# EAGLE design Power_Supply-V_1_0_0_0 (EAGLE 6.4)
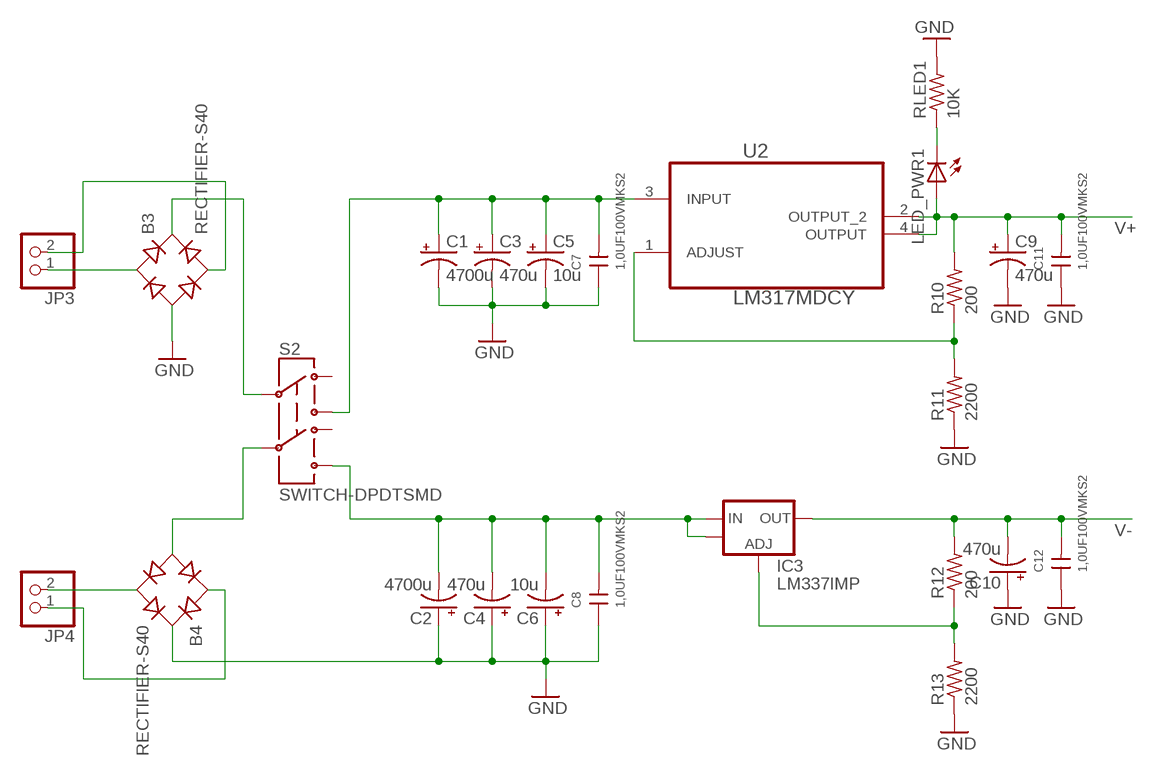
[diagram p0: schematic, sheet 1]

## Parts
B3  RECTIFIER-S40  [TO-269AA]
B4  RECTIFIER-S40  [TO-269AA]
C1  4700u  CPOL-USE7.5-16  [E7,5-16]
C2  4700u  CPOL-USE7.5-16  [E7,5-16]
C3  470u  CPOL-USE3.5-8  [E3,5-8]
C4  470u  CPOL-USE3.5-8  [E3,5-8]
C5  10u  CPOL-USE2-5  [E2-5]
C6  10u  CPOL-USE2-5  [E2-5]
C7  1,0UF100VMKS2  [7,2X13,0RM5,0]
C8  1,0UF100VMKS2  [7,2X13,0RM5,0]
C9  470u  CPOL-USE3.5-8  [E3,5-8]
C10  470u  CPOL-USE3.5-8  [E3,5-8]
C11  1,0UF100VMKS2  [7,2X13,0RM5,0]
C12  1,0UF100VMKS2  [7,2X13,0RM5,0]
IC3  LM337IMP  [SOT-223]
JP3  PINHD-1X2  [1X02]
JP4  PINHD-1X2  [1X02]
LED_PWR1  LEDCHIP-LED0603  [CHIP-LED0603]
R10  200  R-US_R0603  [R0603]
R11  2200  R-US_R0603  [R0603]
R12  200  R-US_R0603  [R0603]
R13  2200  R-US_R0603  [R0603]
RLED1  10K  R-US_R0603  [R0603]
S2  SWITCH-DPDTSMD  [AYZ0202]
U2  LM317MDCY  [SOT230P700X180-4N]

## Nets
GND: B3.- B4.+ C1.- C2.+ C3.- C4.+ C5.- C6.+ C7.1 C8.1 C9.- C10.+ C11.1 C12.1 R11.1 R13.1 RLED1.2
N$2: LED_PWR1.C RLED1.1
N$3: IC3.1(ADJ) R12.1 R13.2
N$8: B3.+ S2.2
N$9: R10.1 R11.2 U2.1(ADJUST)
N$11: B4.- S2.5
N$13: B4.AC1 JP4.1
N$14: B3.AC2 JP3.2
N$15: C1.+ C3.+ C5.+ C7.2 S2.3 U2.3(INPUT)
N$16: B3.AC1 JP3.1
N$17: B4.AC2 JP4.2
N$18: C2.- C4.- C6.- C8.2 IC3.2(IN) IC3.4 S2.6
V+: C9.+ C11.2 LED_PWR1.A R10.2 U2.2(OUTPUT_2) U2.4(OUTPUT)
V-: C10.- C12.2 IC3.3(OUT) R12.2
Unconnected: S2.1 S2.4

## Library data of the parts
B3 B4 = rectifier:RECTIFIER-: Rectifier
C1-C6 C9 C10 = rcl:CPOL-US: POLARIZED CAPACITOR, American symbol
C7 C8 C11 C12 = wima_c:1,0UF100V
IC3 = AWJLEagleLib:LM337: LM337 adjustable negative voltage regulator
JP3 JP4 = pinhead:PINHD-1X2: PIN HEADER
LED_PWR1 = adafruit:LED: LED OSRAM: - CHIPLED LG R971, LG N971, LY N971, LG Q971, LY Q971, LO R971, LY R971 LH N974, LH R974 LS Q976, LO Q976, LY Q976 LO Q996 - Hyper CHIPLED LW Q18S LB Q993, LB Q99A, LB R99A - SideLED LS A670, LO A670, LY A670, LG A670, LP A670 LB A673, LV A673, LT A673, LW A673 LH A674 LY A675 LS A676, LA A676, LO A676, LY A676, LW A676 LS A679, LY A679, LG A679 - Hyper Micro SIDELED® LS Y876, LA Y876, LO Y876, LY Y876 LT Y87S - SmartLED LW L88C, LW L88S LB L89C, LB L89S, LG L890 LS L89K, LO L89K, LY L89K LS L896, LA L896, LO L896, LY L896 - TOPLED LS T670, LO T670, LY T670, LG T670, LP T670 LSG T670, LSP T670, LSY T670, LOP T670, LYG T670 LG T671, LOG T671, LSG T671 LB T673, LV T673, LT T673, LW T673 LH T674 LS T676, LA T676, LO T676, LY T676, LB T676, LH T676, LSB T676, LW T676 LB T67C, LV T67C, LT T67C, LS T67K, LO T67K, LY T67K, LW E67C LS E67B, LA E67B, LO E67B, LY E67B, LB E67C, LV E67C, LT E67C LW T67C LS T679, LY T679, LG T679 LS T770, LO T770, LY T770, LG T770, LP T770 LB T773, LV T773, LT T773, LW T773 LH T774 LS E675, LA E675, LY E675, LS T675 LS T776, LA T776, LO T776, LY T776, LB T776 LHGB T686 LT T68C, LB T68C - Hyper Mini TOPLED® LB M676 - Mini TOPLED Santana® LG M470 LS M47K, LO M47K, LY M47K Source: http://www.osram.convergy.de/
R10-R13 RLED1 = rcl:R-US_: RESISTOR, American symbol
S2 = SparkFun:SWITCH-DPDT: DPDT Version of the COM-00597
U2 = Texas Instruments_By_element14_Batch_1:LM317MDCY: IC ADJ LINEAR REG 1.25V TO 37V; MPN: LM317MDCY; OC_FARNELL: 1648658; OC_NEWARK: 75C0818; PACKAGE: SOT-223-3; SUPPLIER: TEXAS INSTRUMENTS

## Board
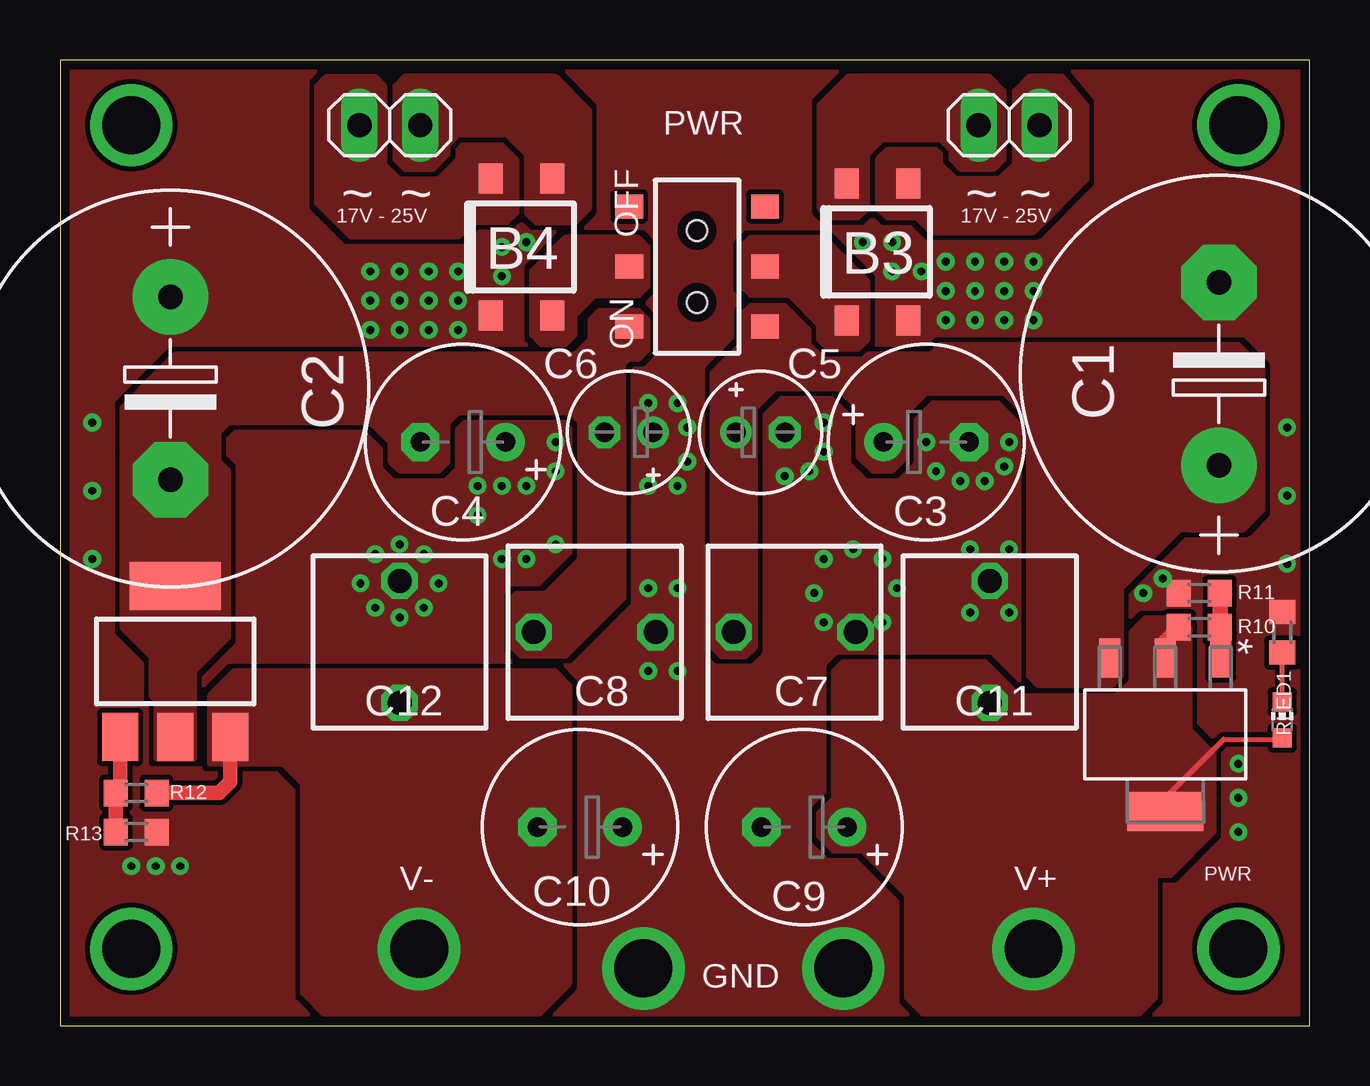
[diagram p1: board, top side]
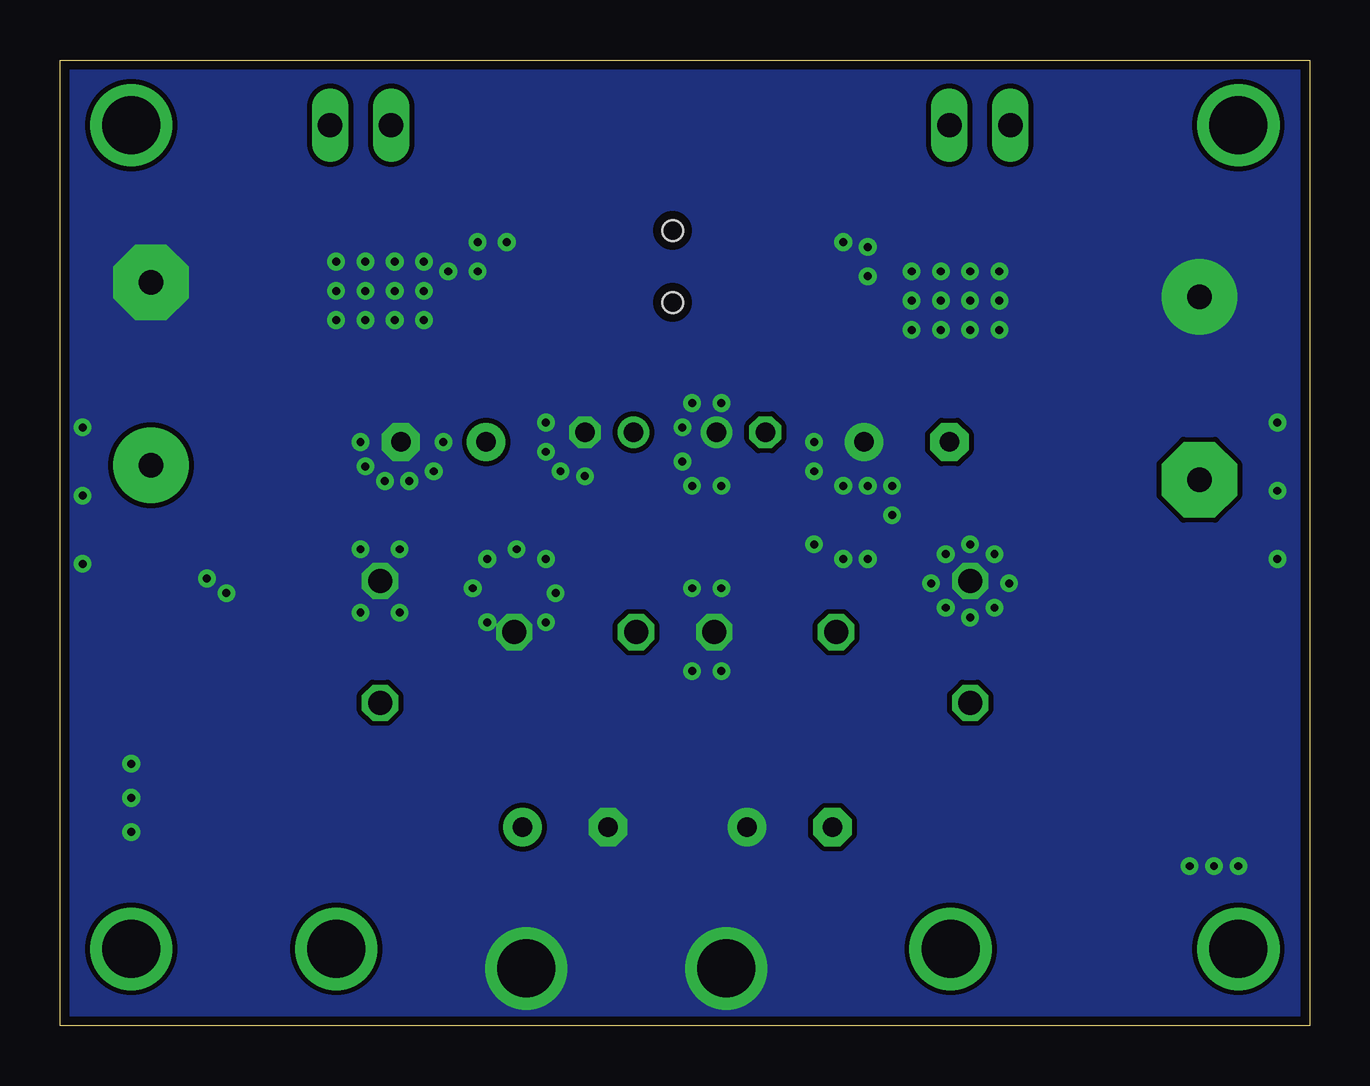
[diagram p2: board, bottom side, seen from below]

Size 52.07 x 40.26 mm. Coordinates in mm from the lower left corner, seen from the top.
Outline: 0,40.26 0,0 52.07,0 52.07,40.26 0,40.26
Copper layers (1*16): Top 0.035mm / dielectric 1.5mm / Bottom 0.035mm
Design rules "default *": minimum track width 8mil, minimum drill 13mil, track to track 8mil, track to pad 8mil, pad to pad 8mil, via to via 8mil, smd to smd 8mil, copper to edge 15mil, drill to drill 8mil, minimum pad ring 10mil, minimum via ring 8mil, stop-mask expansion 4mil, vias tented up to drill 14mil, thermal gap 10mil

### Footprints (pad centres in the part's own frame; a part is rotated, then mirrored left to right if it is on the bottom)
TO-269AA = smd 1 x 1.25: + -1.28,-2.855; - 1.28,-2.855; AC1 -1.28,2.855; AC2 1.28,2.855
E7,5-16 = drill 1.016 pad 3.15: + -3.81,0 | drill 1.016 pad 3.15 octagon: - 3.81,0
E3,5-8 = drill 0.813 pad 1.6: + -1.778,0 | drill 0.813 pad 1.6 octagon: - 1.778,0
E2-5 = drill 0.813 pad 1.27: + -1.016,0 | drill 0.813 pad 1.27 octagon: - 1.016,0
7,2X13,0RM5,0 = drill 1 pad 1.5 octagon: 1 -2.54,0; 2 2.54,0
SOT-223 = smd 1.5 x 2: 1 -2.3,-3.15; 2 0,-3.15; 3 2.3,-3.15 | smd 3.8 x 2: 4 0,3.15
1X02 = drill 1.016 long: 1 -1.27,0; 2 1.27,0
CHIP-LED0603 = smd 0.8 x 0.8: A 0,-0.75; C 0,0.75
R0603 = smd 1 x 1.1: 1 -0.85,0; 2 0.85,0
AYZ0202 = smd 1 x 1.15: 1 -2.5,2.825; 2 0,2.825; 3 2.5,2.825; 4 -2.5,-2.825; 5 0,-2.825; 6 2.5,-2.825 | hole 0.85: 1.5,0; -1.5,0
SOT230P700X180-4N = smd 1.626 x 0.889: 1 -3.2,2.311; 2 -3.2,0; 3 -3.2,-2.311 | smd 1.626 x 3.175: 4 3.2,0

### Placement (x,y rotation side)
B3  34.06,32.26 0 top
B4  19.23,32.47 0 top
C1  48.29,27.18 90 top
C2  4.6,26.57 270 top
C3  36.09,24.34 0 top
C4  16.79,24.34 180 top
C5  29.18,24.74 0 top
C6  23.7,24.74 180 top
C7  30.61,16.41 180 top
C8  22.28,16.41 180 top
C9  31.01,8.29 180 top
C10  21.67,8.29 180 top
C11  38.73,16.01 270 top
C12  14.15,16.01 270 top
IC3  4.8,15.19 0 top
JP3  39.55,37.55 0 top
JP4  13.74,37.55 0 top
LED_PWR1  50.93,12.76 0 top
R10  47.47,16.62 180 top
R11  47.47,18.04 0 top
R12  3.17,9.71 0 top
R13  3.17,8.08 180 top
RLED1  50.93,16.41 90 top
S2  26.54,31.65 270 top
U2  46.05,12.15 270 top

### Tracks (layer width: path | path; a pad name or v marks a point on that pad's centre or on a via)
GND  (via drill 0.33, 2.41)
  other vias: 16.59,29.01 15.37,29.01 14.15,29.01 12.93,29.01 16.59,30.23 15.37,30.23 14.15,30.23 12.93,30.23 16.59,31.45 15.37,31.45 14.15,31.45 12.93,31.45 19.43,32.67 18.41,32.47 18.41,31.25 36.91,29.42 38.13,29.42 39.34,29.42 40.56,29.42 36.91,30.64 38.13,30.64 39.34,30.64 40.56,30.64 40.56,31.86 39.34,31.86 38.13,31.86 36.91,31.86 33.45,32.67 34.67,32.67 34.67,31.45 35.89,31.45 1.35,25.15 1.35,22.31 1.35,19.46 3.99,6.66 5,6.66 2.97,6.66 20.65,24.34 20.65,23.12 20.65,20.07 19.43,22.51 19.43,19.46 18.41,22.51 18.41,19.46 17.4,22.51 17.4,21.29 24.51,25.96 25.73,25.96 26.14,24.95 26.14,23.53 25.73,22.51 24.51,22.51 24.51,18.24 25.73,18.24 25.73,14.79 24.51,14.79 39.55,24.34 36.09,24.34 36.5,23.12 37.52,22.71 38.53,22.71 39.34,23.32 31.83,25.15 31.83,23.93 31.22,23.12 30.2,22.92 31.42,18.04 33.05,16.41 34.87,18.24 33.05,19.87 31.83,19.46 31.83,16.82 34.26,16.82 34.26,19.46 45.95,18.65 45.14,18.04 24.31,2.39 51.13,24.95 51.13,22.1 51.13,19.26 39.55,17.23 37.92,17.23 37.92,19.87 39.55,19.87 15.16,17.43 13.13,17.43 13.13,19.66 15.16,19.66 15.77,18.45 12.52,18.45 14.15,17.02 14.15,20.07 49.1,10.93 49.1,9.5 49.1,8.08 32.64,2.39
  pour Top (rank 6, no thermals): 51.74,39.98 51.74,0.36 0.33,0.36 0.33,39.98
  pour Bottom (rank 6, no thermals): 51.74,39.98 51.74,0.36 0.33,0.36 0.33,39.98
MNT_1  (via drill 2.41)
  other vias: 2.97,37.55
MNT_2  (via drill 2.41)
  other vias: 49.1,37.55
MNT_4  (via drill 2.41)
  other vias: 2.97,3.21
N$2
  Top 0.203: LED_PWR1.C RLED1.1
N$3
  Top 0.61: IC3.1 2.5,9.88 R12.1 R13.2
N$6  (via drill 2.41)
  other vias: 49.1,3.21
N$8
  pour Top (rank 5, no thermals): 28.78,32.87 31.83,32.87 33.66,31.04 33.66,28.61 33.25,28.2 32.03,28.2 31.62,28.61 31.62,29.22 30.4,30.43 28.78,30.43 28.37,30.84 28.37,32.47
N$9
  Top 0.61: U2.1 48.36,18 R10.1 R11.2
N$11
  pour Top (rank 5, no thermals): 24.1,32.87 21.06,32.87 19.63,31.45 19.63,28.81 20.04,28.4 21.06,28.4 21.46,28.81 21.46,29.62 22.28,30.43 24.1,30.43 24.51,30.84 24.51,32.47
N$13
  pour Top (rank 5, no thermals): 13.54,39.17 13.54,35.92 14.15,35.31 15.77,35.31 16.59,36.12 16.59,36.53 16.79,36.73 18.41,36.73 19.02,36.12 19.02,33.89 18.62,33.48 17.2,33.48 16.59,32.87 12.12,32.87 10.69,34.3 10.69,39.17 11.1,39.58 13.13,39.58
N$14
  pour Top (rank 5, no thermals): 39.75,38.97 39.75,35.92 39.14,35.31 37.31,35.31 36.7,35.92 36.7,36.33 36.5,36.53 34.47,36.53 34.06,36.12 34.06,34.09 34.47,33.69 35.69,33.69 36.3,33.08 40.56,33.08 42.8,35.31 42.8,38.36 41.78,39.58 40.36,39.58
N$15
  pour Top (rank 5, no thermals): 30.2,30.03 28.78,30.03 28.37,29.62 28.37,28.4 27.15,27.18 27.15,15.8 27.56,15.4 28.57,15.4 28.98,15.8 28.98,25.76 29.79,26.57 32.44,26.57 33.25,25.76 33.25,23.73 33.86,23.12 34.67,23.12 35.28,23.73 35.28,25.56 36.09,26.37 45.64,26.37 46.25,25.76 46.25,21.49 47.07,20.68 49.3,20.68 50.11,21.49 50.11,27.39 49.1,28.4 36.7,28.4 36.3,28 33.66,28 33.45,27.79 31.83,27.79 31.22,28.4 31.22,29.01
  pour Top (rank 5, no thermals): 50.11,27.39 50.11,21.49 49.3,20.68 46.66,20.68 44.22,18.24 44.22,14.58 43.81,14.18 40.77,14.18 40.36,14.58 40.36,25.35 39.34,26.37 39.34,28.4 49.1,28.4
N$16
  pour Top (rank 5, no thermals): 39.34,36.12 39.34,38.97 38.73,39.58 32.84,39.58 31.62,38.36 31.62,34.09 32.03,33.69 33.25,33.69 33.66,34.09 33.66,36.33 34.26,36.94 36.7,36.94 37.11,36.53 37.11,36.12 37.52,35.72 38.94,35.72
N$17
  pour Top (rank 5, no thermals): 13.94,39.17 13.94,36.12 14.35,35.72 15.57,35.72 16.18,36.33 16.18,36.73 16.59,37.14 18.62,37.14 19.43,36.33 19.43,33.89 19.84,33.48 21.46,33.48 22.07,34.09 22.07,38.16 20.65,39.58 14.35,39.58
N$18
  pour Top (rank 5, no thermals): 24.1,29.82 22.48,29.82 22.07,29.42 22.07,28.61 21.46,28 4.8,28 2.57,25.76 2.57,23.93 3.78,22.71 5.41,22.71 6.43,23.73 6.43,24.54 7.04,25.15 12.93,25.15 13.74,24.34 13.74,23.53 14.15,23.12 15.77,23.12 16.18,23.53 16.18,25.15 16.59,25.56 21.26,25.56 21.67,25.15 21.67,23.73 22.07,23.32 23.09,23.32 23.49,23.73 23.49,27.59 23.7,27.79 24.1,27.79 24.51,28.2 24.51,29.42
  pour Top (rank 5, no thermals): 19.23,15.4 18.82,15.8 18.82,17.84 19.02,18.04 20.24,18.04 21.67,19.46 21.67,25.35 23.49,25.35 23.49,17.84 21.06,15.4
  pour Top (rank 5, no thermals): 6.63,27.18 3.99,27.18 2.57,25.76 2.57,16.62 3.78,15.4 3.78,13.77 3.99,13.57 3.99,11.13 5.61,11.13 5.61,14.79 7.04,16.21 7.04,23.12 6.63,23.53
V+  (via drill 2.41)
  Top 0.203: U2.4 46.05,9.51 48.49,11.94 50.86,11.94 LED_PWR1.A
  Top 0.61: U2.2 46.05,16.04 R10.2
  other vias: 40.56,3.21
  pour Top (rank 5, no thermals): 47.07,16.62 47.07,12.35 48.08,11.33 48.08,8.08 46.25,6.25 45.64,6.25 45.64,1.17 44.83,0.36 36.09,0.36 35.28,1.17 35.28,5.44 33.45,7.27 32.23,7.27 31.62,7.88 31.62,8.9 32.23,9.5 32.23,14.79 32.64,15.19 38.53,15.19 39.95,13.77 44.02,13.77 44.63,14.38 44.63,16.41 45.24,17.02 46.66,17.02
V-  (via drill 2.41)
  Top 0.61: IC3.3 7.1,10.18 6.63,9.71 R12.2
  other vias: 14.96,3.21
  pour Top (rank 5, no thermals): 21.26,1.78 21.26,14.18 20.65,14.79 7.24,14.79 6.22,13.77 6.22,10.93 9.27,10.93 10.08,10.11 10.08,1.38 11.1,0.36 19.84,0.36

### Text on the board
tPlace: PWR | 17V - 25V | ~ | ~ | 17V - 25V | ~ | ~ | OFF | ON | V- | V+ | PWR | GND